# EAGLE design phare (EAGLE 9.6.2)
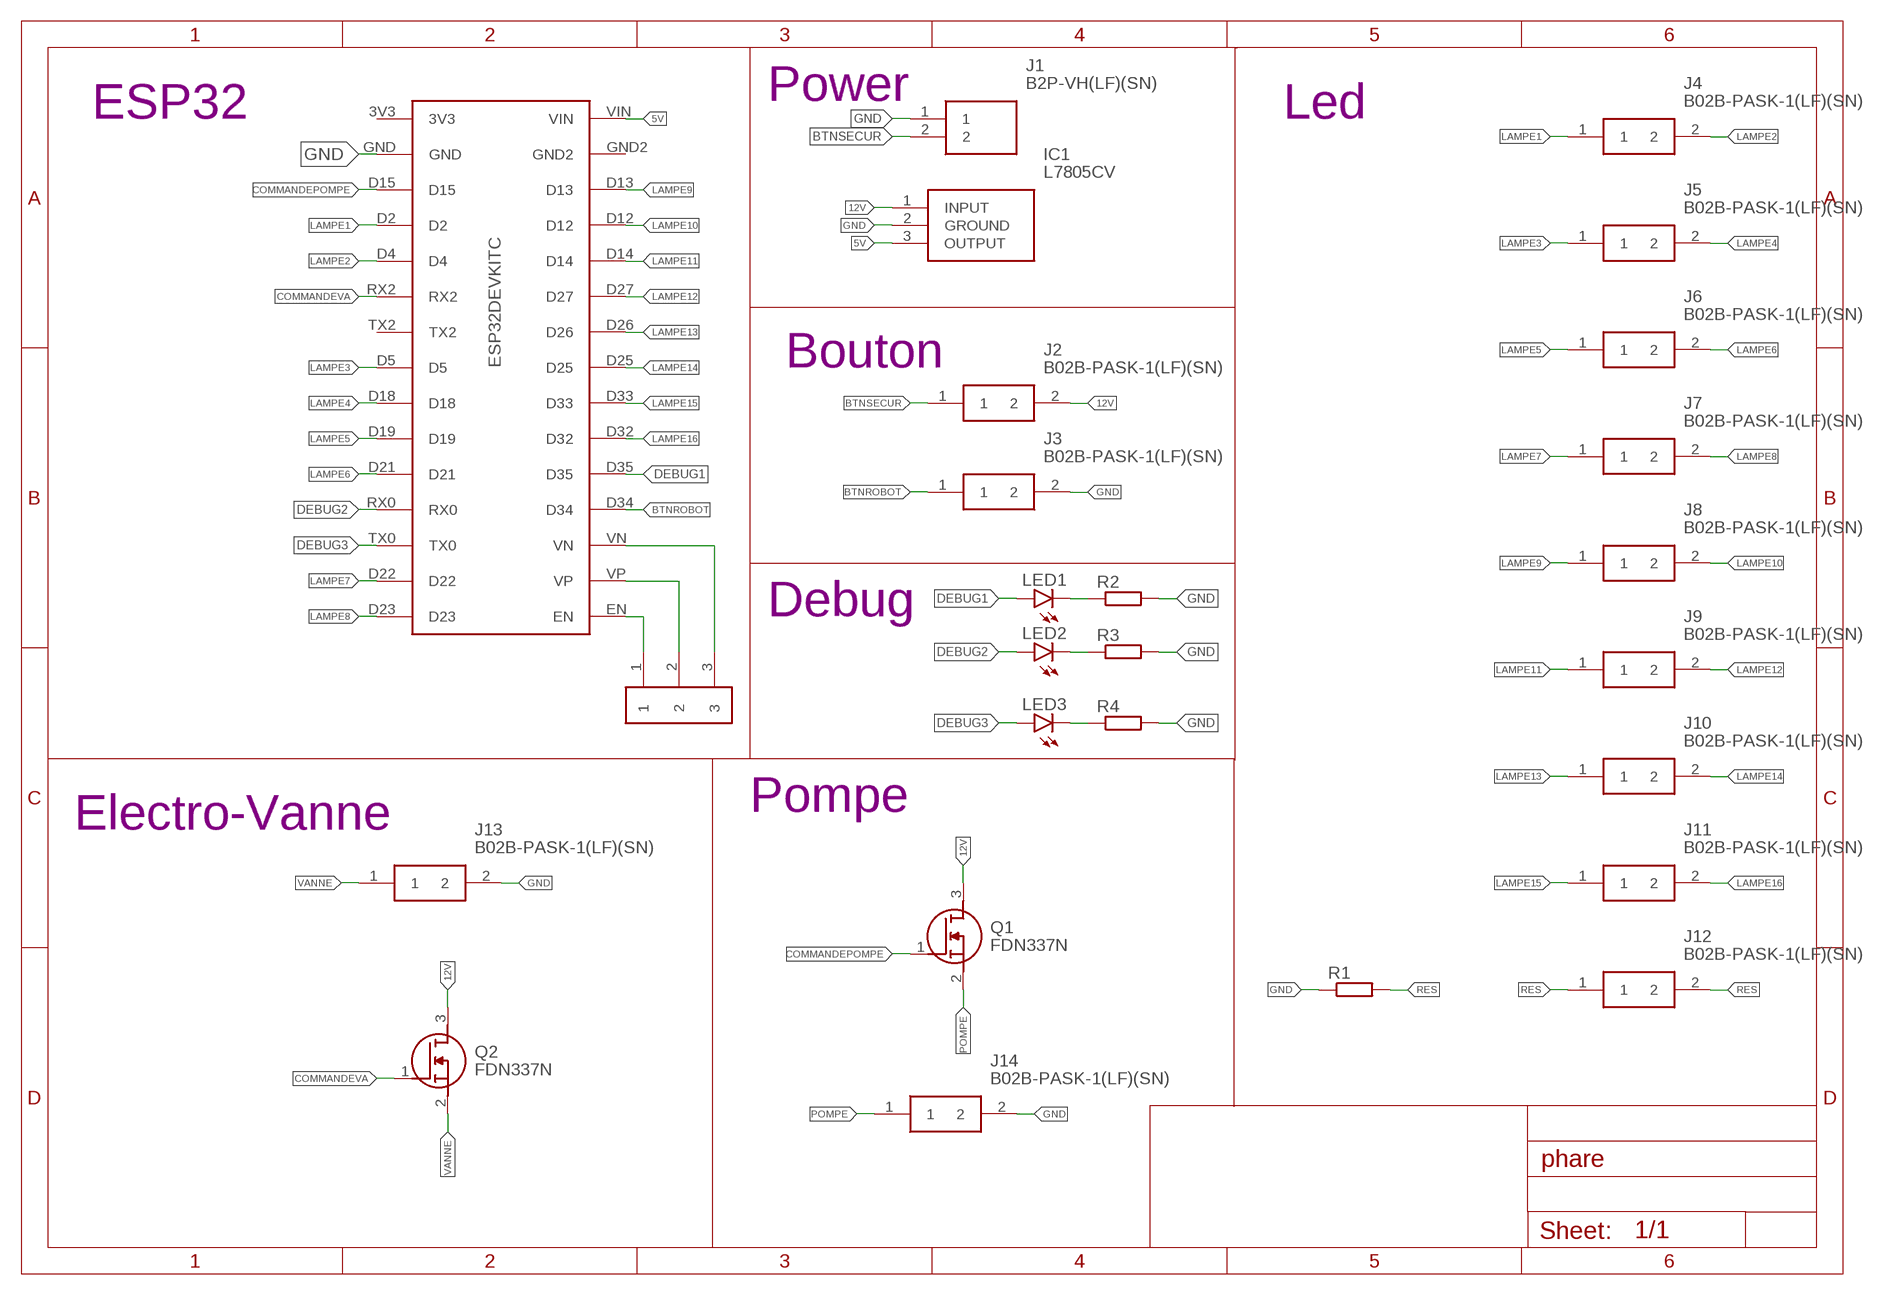
[diagram p0: schematic, sheet 1]

## Parts
IC1  L7805CV  [TO255P460X1020X2008-3P]
J1  B2P-VH(LF)(SN)  [SHDR2W114P0X396_1X2_786X850X94]
J2  B02B-PASK-1(LF)(SN)  [B02BPASK1LFSN]
J3  B02B-PASK-1(LF)(SN)  [B02BPASK1LFSN]
J4  B02B-PASK-1(LF)(SN)  [B02BPASK1LFSN]
J5  B02B-PASK-1(LF)(SN)  [B02BPASK1LFSN]
J6  B02B-PASK-1(LF)(SN)  [B02BPASK1LFSN]
J7  B02B-PASK-1(LF)(SN)  [B02BPASK1LFSN]
J8  B02B-PASK-1(LF)(SN)  [B02BPASK1LFSN]
J9  B02B-PASK-1(LF)(SN)  [B02BPASK1LFSN]
J10  B02B-PASK-1(LF)(SN)  [B02BPASK1LFSN]
J11  B02B-PASK-1(LF)(SN)  [B02BPASK1LFSN]
J12  B02B-PASK-1(LF)(SN)  [B02BPASK1LFSN]
J13  B02B-PASK-1(LF)(SN)  [B02BPASK1LFSN]
J14  B02B-PASK-1(LF)(SN)  [B02BPASK1LFSN]
LED1  LEDCHIP-LED0805  [CHIP-LED0805]
LED2  LEDCHIP-LED0805  [CHIP-LED0805]
LED3  LEDCHIP-LED0805  [CHIP-LED0805]
Q1  FDN337N  [SOT95P237X112-3N]
Q2  FDN337N  [SOT95P237X112-3N]
R1  R-EU_R0805  [R0805]
R2  R-EU_R0805  [R0805]
R3  R-EU_R0805  [R0805]
R4  R-EU_R0805  [R0805]
U$1  ESP32DEVKITC  [ESP32FOOTPRINT]
U$2  HEADER3PIN  [HEADER3PINFOOTPRINT]

## Nets
5V: IC1.3(OUTPUT) U$1.VIN
12V: IC1.1(INPUT) J2.2 Q1.3(D) Q2.3(D)
BTNROBOT: J3.1 U$1.D34
BTNSECUR: J1.2 J2.1
COMMANDEPOMPE: Q1.1(G) U$1.D15
COMMANDEVA: Q2.1(G) U$1.RX2
DEBUG1: LED1.A U$1.D35
DEBUG2: LED2.A U$1.RX0
DEBUG3: LED3.A U$1.TX0
GND: IC1.2(GROUND) J1.1 J3.2 J13.2 J14.2 R1.1 R2.2 R3.2 R4.2 U$1.GND
LAMPE1: J4.1 U$1.D2
LAMPE2: J4.2 U$1.D4
LAMPE3: J5.1 U$1.D5
LAMPE4: J5.2 U$1.D18
LAMPE5: J6.1 U$1.D19
LAMPE6: J6.2 U$1.D21
LAMPE7: J7.1 U$1.D22
LAMPE8: J7.2 U$1.D23
LAMPE9: J8.1 U$1.D13
LAMPE10: J8.2 U$1.D12
LAMPE11: J9.1 U$1.D14
LAMPE12: J9.2 U$1.D27
LAMPE13: J10.1 U$1.D26
LAMPE14: J10.2 U$1.D25
LAMPE15: J11.1 U$1.D33
LAMPE16: J11.2 U$1.D32
N$1: LED1.C R2.1
N$2: LED2.C R3.1
N$3: LED3.C R4.1
N$4: U$1.EN U$2.1
N$5: U$1.VP U$2.2
N$6: U$1.VN U$2.3
POMPE: J14.1 Q1.2(S)
RES: J12.1 J12.2 R1.2
VANNE: J13.1 Q2.2(S)
Unconnected: U$1.3V3 U$1.GND2 U$1.TX2

## Notes on the sheet
- Power
- ESP32 | Led
- Bouton
- Debug
- Pompe
- Electro-Vanne

## Library data of the parts
IC1 = SamacSys_Parts:L7805CV: Linear voltage regulator,L7805CV 5V 1.5A STMicroelectronics L7805CV, Single Linear Voltage Regulator, 1.5A 5 V, 3-Pin TO-220 Source: Datasheet <http://www.st.com/web/en/resource/technical/document/datasheet/CD00000444.pdf>; ARROW_PART_NUMBER: L7805CV; ARROW_PRICE-STOCK: https://www.arrow.com/en/products/l7805cv/stmicroelectronics; DESCRIPTION: Linear voltage regulator,L7805CV 5V 1.5A STMicroelectronics L7805CV, Single Linear Voltage Regulator, 1.5A 5 V, 3-Pin TO-220; HEIGHT: 4.6mm; MANUFACTURER_NAME: STMicroelectronics; MANUFACTURER_PART_NUMBER: L7805CV; MOUSER_PART_NUMBER: 511-L7805CV; MOUSER_PRICE-STOCK: https://www.mouser.co.uk/ProductDetail/STMicroelectronics/L7805CV/?qs=9NrABl3fj%2FqplZAHiYUxWg%3D%3D
J1 = INTech:B2P-VH(LF)(SN): connector,multipole PCB use,B2P-VH,VH se JST VH Series, 3.96mm Pitch 2 Way 1 Row Straight PCB Header, Solder Termination, 10A Source: Datasheet <http://www.jst-mfg.com/product/pdf/eng/eVH.pdf>; DESCRIPTION: connector,multipole PCB use,B2P-VH,VH se JST VH Series, 3.96mm Pitch 2 Way 1 Row Straight PCB Header, Solder Termination, 10A; HEIGHT: 9.4mm; MANUFACTURER_NAME: JST (JAPAN SOLDERLESS TERMINALS); MANUFACTURER_PART_NUMBER: B2P-VH(LF)(SN); RS_PART_NUMBER: 8201147P; RS_PRICE-STOCK: http://uk.rs-online.com/web/p/products/8201147P
J2-J14 = INTech:B02B-PASK-1(LF)(SN): CONN HEADER VERT 2POS 2MM Source: Datasheet <http://www.jst-mfg.com/product/pdf/eng/ePA-F.pdf>; DESCRIPTION: CONN HEADER VERT 2POS 2MM; HEIGHT: 7.7mm; MANUFACTURER_NAME: JST (JAPAN SOLDERLESS TERMINALS); MANUFACTURER_PART_NUMBER: B02B-PASK-1(LF)(SN)
LED1-LED3 = INTech:LED: LED OSRAM: - CHIPLED LG R971, LG N971, LY N971, LG Q971, LY Q971, LO R971, LY R971 LH N974, LH R974 LS Q976, LO Q976, LY Q976 LO Q996 - Hyper CHIPLED LW Q18S LB Q993, LB Q99A, LB R99A - SideLED LS A670, LO A670, LY A670, LG A670, LP A670 LB A673, LV A673, LT A673, LW A673 LH A674 LY A675 LS A676, LA A676, LO A676, LY A676, LW A676 LS A679, LY A679, LG A679 - Hyper Micro SIDELED® LS Y876, LA Y876, LO Y876, LY Y876 LT Y87S - SmartLED LW L88C, LW L88S LB L89C, LB L89S, LG L890 LS L89K, LO L89K, LY L89K LS L896, LA L896, LO L896, LY L896 - TOPLED LS T670, LO T670, LY T670, LG T670, LP T670 LSG T670, LSP T670, LSY T670, LOP T670, LYG T670 LG T671, LOG T671, LSG T671 LB T673, LV T673, LT T673, LW T673 LH T674 LS T676, LA T676, LO T676, LY T676, LB T676, LH T676, LSB T676, LW T676 LB T67C, LV T67C, LT T67C, LS T67K, LO T67K, LY T67K, LW E67C LS E67B, LA E67B, LO E67B, LY E67B, LB E67C, LV E67C, LT E67C LW T67C LS T679, LY T679, LG T679 LS T770, LO T770, LY T770, LG T770, LP T770 LB T773, LV T773, LT T773, LW T773 LH T774 LS E675, LA E675, LY E675, LS T675 LS T776, LA T776, LO T776, LY T776, LB T776 LHGB T686 LT T68C, LB T68C - Hyper Mini TOPLED® LB M676 - Mini TOPLED Santana® LG M470 LS M47K, LO M47K, LY M47K Source: http://www.osram.convergy.de LUXEON: - LUMILED® LXK2-PW12-R00, LXK2-PW12-S00, LXK2-PW14-U00, LXK2-PW14-V00 LXK2-PM12-R00, LXK2-PM12-S00, LXK2-PM14-U00 LXK2-PE12-Q00, LXK2-PE12-R00, LXK2-PE12-S00, LXK2-PE14-T00, LXK2-PE14-U00 LXK2-PB12-K00, LXK2-PB12-L00, LXK2-PB12-M00, LXK2-PB14-N00, LXK2-PB14-P00, LXK2-PB14-Q00 LXK2-PR12-L00, LXK2-PR12-M00, LXK2-PR14-Q00, LXK2-PR14-R00 LXK2-PD12-Q00, LXK2-PD12-R00, LXK2-PD12-S00 LXK2-PH12-R00, LXK2-PH12-S00 LXK2-PL12-P00, LXK2-PL12-Q00, LXK2-PL12-R00 Source: www.luxeon.com KINGBRIGHT: KA-3528ASYC Source: www.kingbright.com
Q1 Q2 = INTech:FDN337N: FDN337N N-Channel MOSFET, 2.2 A, 30 V, 3-Pin SOT-23 ON Semiconductor Source: Datasheet <https://www.onsemi.com/pub/Collateral/FDN337N-D.PDF>; DESCRIPTION: FDN337N N-Channel MOSFET, 2.2 A, 30 V, 3-Pin SOT-23 ON Semiconductor; HEIGHT: 1.12mm; MANUFACTURER_NAME: ON Semiconductor; MANUFACTURER_PART_NUMBER: FDN337N; MOUSER_PART_NUMBER: 512-FDN337N; MOUSER_PRICE-STOCK: https://www.mouser.com/Search/Refine.aspx?Keyword=512-FDN337N; RS_PART_NUMBER: 6710429P; RS_PRICE-STOCK: http://uk.rs-online.com/web/p/products/6710429P
R1-R4 = INTech:R-EU_: RESISTOR, European symbol; SPICEPREFIX: R
U$1 = INTech:ESP32DEVKITC
U$2 = INTech:HEADER3PIN

## Board
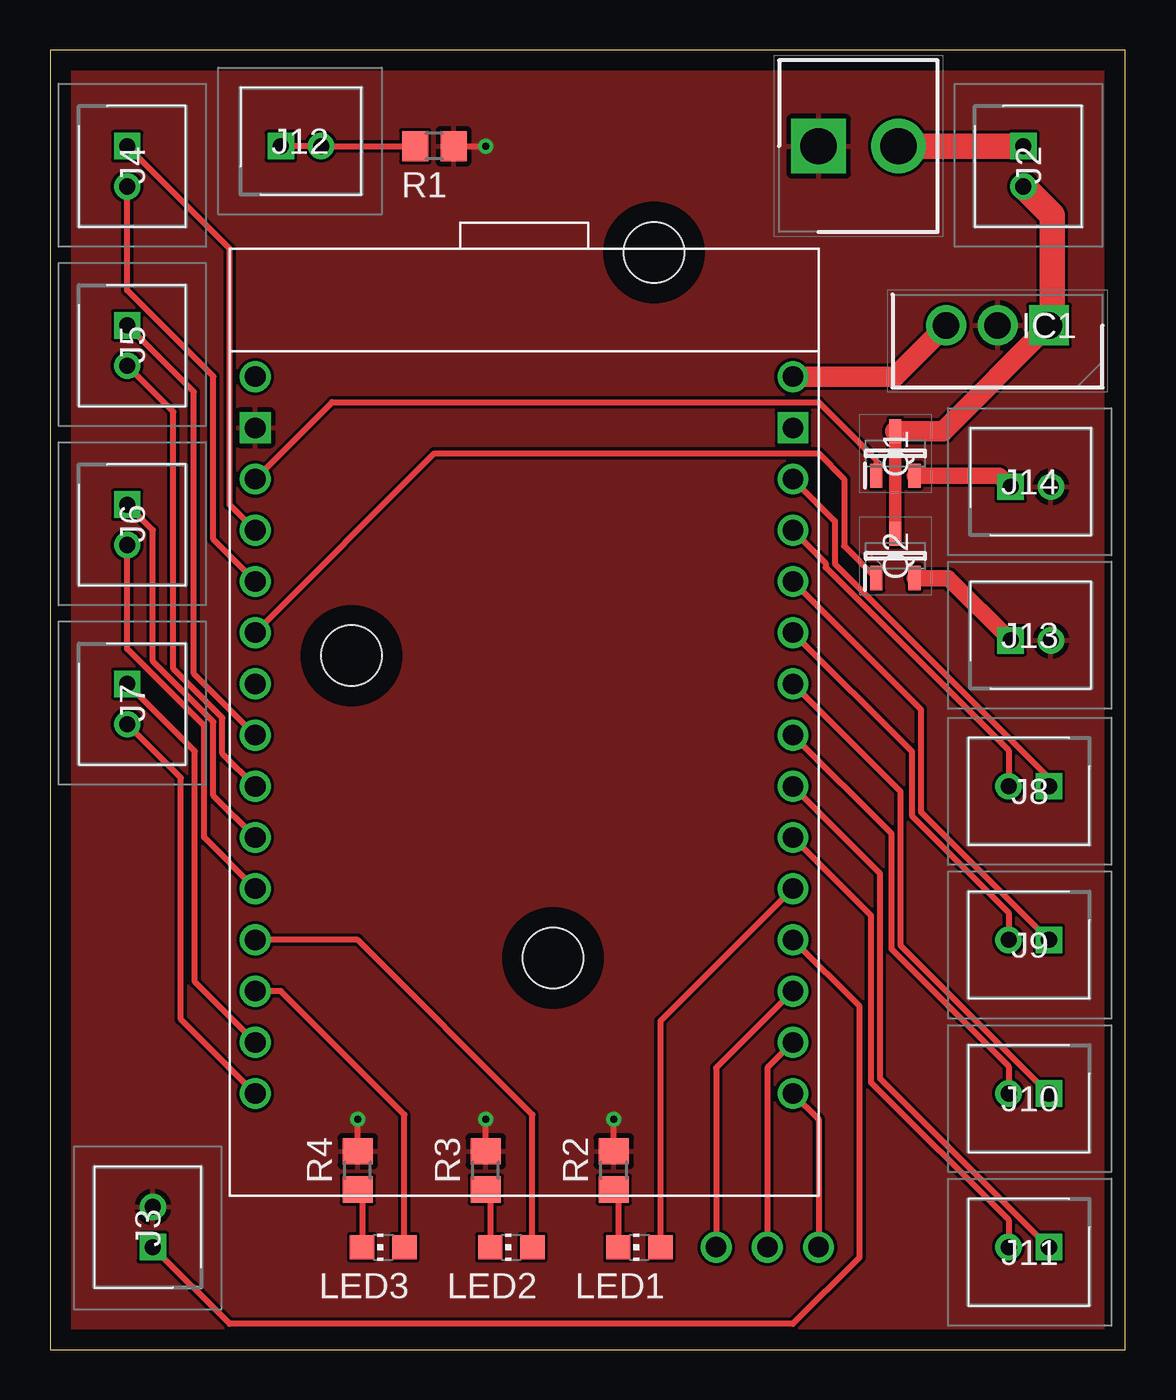
[diagram p1: board, top side]
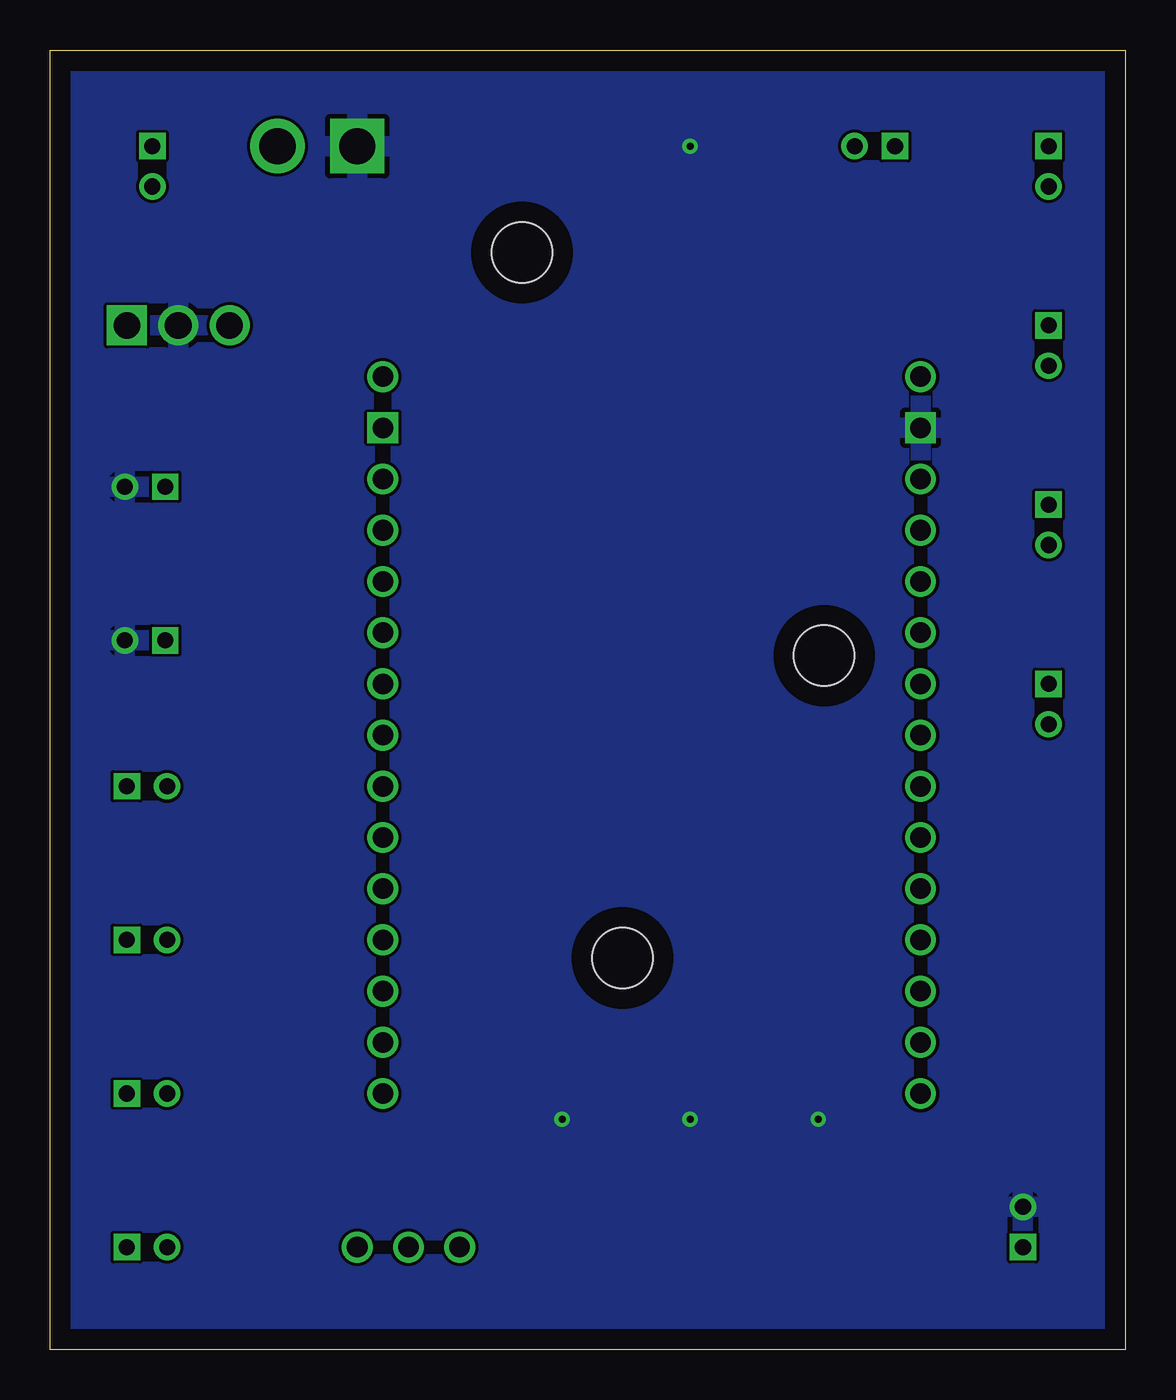
[diagram p2: board, bottom side, seen from below]

Size 53.32 x 64.44 mm. Coordinates in mm from the lower left corner, seen from the top.
Outline: 0,0 53.32,0 53.32,64.44 0,64.44 0,0
Copper layers (1*16): Top 0.035mm / dielectric 1.5mm / Bottom 0.035mm
Design rules "default": minimum track width 6mil, minimum drill 0.35mm, track to track 6mil, track to pad 6mil, pad to pad 6mil, via to via 6mil, smd to smd 6mil, copper to edge 40mil, drill to drill 6mil, minimum pad ring 10mil, minimum via ring 8mil, stop-mask expansion 4mil, vias tented up to drill 0mil, thermal gap 10mil
Holes 3 mm at 24.94,19.42 29.94,54.42 14.94,34.42

### Footprints (pad centres in the part's own frame; a part is rotated, then mirrored left to right if it is on the bottom)
TO255P460X1020X2008-3P = drill 1.32 pad 1.98 square: 1 0,0 | drill 1.32 pad 1.98: 2 2.55,0; 3 5.1,0
SHDR2W114P0X396_1X2_786X850X94 = drill 1.8 pad 2.7 square: 1 0,0 | drill 1.8 pad 2.7: 2 3.96,0
B02BPASK1LFSN = drill 0.8 pad 1.3 square: 1 0,0 | drill 0.8 pad 1.3: 2 -2,0
CHIP-LED0805 = smd 1.2 x 1.2: A 0,-1.05; C 0,1.05
SOT95P237X112-3N = smd 1.2 x 0.6: 1 -1.1,0.95; 2 -1.1,-0.95; 3 1.1,0
R0805 = smd 1.3 x 1.5: 1 -0.95,0; 2 0.95,0
ESP32FOOTPRINT = drill 1.02: 3V3 1.27,-6.35; D2 1.27,-13.97; D4 1.27,-16.51; D5 1.27,-24.13; D12 27.94,-13.97; D13 27.94,-11.43; D14 27.94,-16.51; D15 1.27,-11.43; D18 1.27,-26.67; D19 1.27,-29.21; D21 1.27,-31.75; D22 1.27,-39.37; D23 1.27,-41.91; D25 27.94,-24.13; D26 27.94,-21.59; D27 27.94,-19.05; D32 27.94,-29.21; D33 27.94,-26.67; D34 27.94,-34.29; D35 27.94,-31.75; EN 27.94,-41.91; RX0 1.27,-34.29; RX2 1.27,-19.05; TX0 1.27,-36.83; TX2 1.27,-21.59; VIN 27.94,-6.35; VN 27.94,-36.83; VP 27.94,-39.37 | drill 1.02 square: GND 1.27,-8.89; GND2 27.94,-8.89
HEADER3PINFOOTPRINT = drill 1.02: 1 0,2.54; 2 0,0; 3 0,-2.54

### Placement (x,y rotation side)
IC1  49.53,50.8 180 top
J1  38.1,59.69 0 top
J2  48.26,59.69 90 top
J3  5.08,5.08 270 top
J4  3.81,59.69 90 top
J5  3.81,50.8 90 top
J6  3.81,41.91 90 top
J7  3.81,33.02 90 top
J8  49.53,27.94 0 top
J9  49.53,20.32 0 top
J10  49.53,12.7 0 top
J11  49.53,5.08 0 top
J12  11.43,59.69 180 top
J13  47.62,35.18 180 top
J14  47.62,42.8 180 top
LED1  29.21,5.08 90 top
LED2  22.86,5.08 90 top
LED3  16.51,5.08 90 top
Q1  41.91,44.45 90 top
Q2  41.91,39.37 90 top
R1  19.05,59.69 180 top
R2  27.94,8.89 90 top
R3  21.59,8.89 90 top
R4  15.24,8.89 90 top
U$1  8.89,54.61 0 top
U$2  35.56,5.08 270 top

### Tracks (layer width: path | path; a pad name or v marks a point on that pad's centre or on a via)
5V
  Top 1.016: IC1.3 41.89,48.26 U$1.VIN
12V
  Top 0.61: Q1.3 Q2.3
  Top 1.016: 49.68,50.95 IC1.1 44.28,45.55 Q1.3
  Top 1.27: J2.2 49.68,56.27 49.68,50.95
BTNROBOT
  Top 0.305: J3.1 8.89,1.27 36.83,1.27 40.13,4.57 40.13,17.02 U$1.D34
BTNSECUR
  Top 1.27: J1.2 J2.1
COMMANDEPOMPE
  Top 0.305: U$1.D15 13.97,46.99 38.1,46.99 40.96,44.13 Q1.1
COMMANDEVA
  Top 0.305: U$1.RX2 19.05,44.45 38.1,44.45 39.37,43.18 39.37,39.86 Q2.1
DEBUG1
  Top 0.305: U$1.D35 30.26,16.29 LED1.A
DEBUG2
  Top 0.305: LED2.A 23.91,11.65 15.24,20.32 U$1.RX0
DEBUG3
  Top 0.305: LED3.A 17.56,11.65 11.43,17.78 U$1.TX0
GND  (via drill 0.35)
  Top 0.305: R4.2 v15.24,11.43 | R3.2 v21.59,11.43 | R2.2 v27.94,11.43 | R1.1 v21.59,59.69
  pour Bottom: -10.3,69.83 57.04,69.83 65.12,77.9 65.12,-10.58 -10.3,-10.58
  pour Top: -10.06,69.42 54.94,69.42 59.94,64.42 59.94,-0.58 54.94,-5.58 -5.06,-5.58 -10.06,-0.58
LAMPE1
  Top 0.305: U$1.D2 8.89,41.91 8.89,54.61 J4.1
LAMPE2
  Top 0.305: U$1.D4 8.08,40.18 8.08,48.27 3.81,52.54 J4.2
LAMPE3
  Top 0.305: U$1.D5 7.11,33.53 7.11,47.5 J5.1
LAMPE4
  Top 0.305: U$1.D18 8.53,29.57 8.53,31.33 6.1,33.77 6.1,46.51 J5.2
LAMPE5
  Top 0.305: U$1.D19 8.08,27.48 8.08,31.14 5.08,34.14 5.08,40.64 J6.1
LAMPE6
  Top 0.305: U$1.D21 7.62,25.4 7.62,30.95 3.81,34.76 J6.2
LAMPE7
  Top 0.305: U$1.D22 7.16,18.24 7.16,29.67 J7.1
LAMPE8
  Top 0.305: U$1.D23 6.48,16.38 6.48,28.35 J7.2
LAMPE9
  Top 0.305: U$1.D13 38.91,41.1 38.91,38.99 49.53,28.37 J8.1
LAMPE10
  Top 0.305: U$1.D12 38.46,39.01 38.46,38.8 47.53,29.72 J8.2
LAMPE11
  Top 0.305: U$1.D14 43.18,31.75 43.18,26.67 J9.1
LAMPE12
  Top 0.305: U$1.D27 42.72,29.67 42.72,26.48 47.53,21.67 J9.2
LAMPE13
  Top 0.305: U$1.D26 42.16,27.69 42.16,20.07 J10.1
LAMPE14
  Top 0.305: U$1.D25 41.71,25.6 41.71,19.88 47.53,14.05 J10.2
LAMPE15
  Top 0.305: U$1.D33 41.15,23.62 41.15,13.46 J11.1
LAMPE16
  Top 0.305: U$1.D32 40.69,21.54 40.69,13.27 47.53,6.43 J11.2
N$1
  Top 0.305: R2.1 28.16,7.72 LED1.C
N$2
  Top 0.305: R3.1 21.81,7.72 LED2.C
N$3
  Top 0.305: R4.1 15.46,7.72 LED3.C
N$4
  Top 0.305: U$1.EN 38.1,11.43 U$2.1
N$5
  Top 0.305: U$1.VP 35.56,13.97 U$2.2
N$6
  Top 0.305: U$1.VN 33.02,13.97 U$2.3
POMPE
  Top 0.813: Q1.2 47.07,43.35 J14.1
RES
  Top 0.305: R1.2 J12.2 J12.1
VANNE
  Top 0.813: Q2.2 44.53,38.27 J13.1

### Text on the board
tValues: INTech / Tech The Tiller | arrêt d'urgence | Cathode | batterie | Led | Convertisseur 12 to 5 | Led | Pompe | Led | Vanne | Led | Led | SUUS | Led | Bouton / Activation | Led | Input test | Led